# EAGLE schematic mixer headphone amp (EAGLE 6.4)
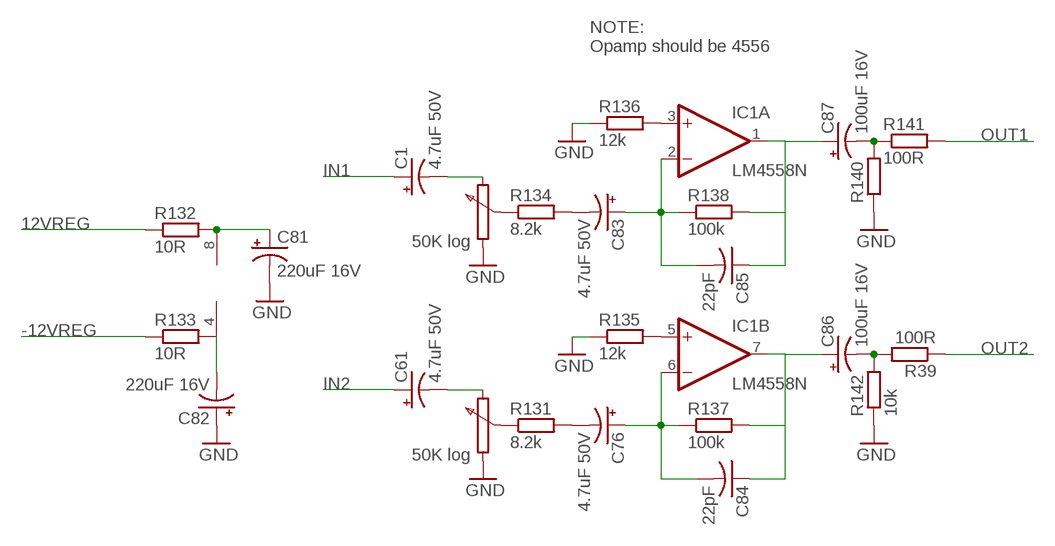
[diagram p0: schematic, sheet 1]

## Parts
C1  4.7uF 50V  CPOL-USE2.5-5  [E2,5-5]
C61  4.7uF 50V  CPOL-USE2.5-5  [E2,5-5]
C76  4.7uF 50V  CPOL-USE2.5-5  [E2,5-5]
C81  220uF 16V  CPOL-USE2.5-5  [E2,5-5]
C82  220uF 16V  CPOL-USE2.5-5  [E2,5-5]
C83  4.7uF 50V  CPOL-USE2.5-5  [E2,5-5]
C84  22pF  C-US025-025X050  [C025-025X050]
C85  22pF  C-US025-025X050  [C025-025X050]
C86  100uF 16V  CPOL-USE2.5-5  [E2,5-5]
C87  100uF 16V  CPOL-USE2.5-5  [E2,5-5]
IC1  LM4558N  [DIL08]
R39  100R  R-EU_0204/7  [0204/7]
R131  8.2k  R-EU_0204/7  [0204/7]
R132  10R  R-EU_0204/7  [0204/7]
R133  10R  R-EU_0204/7  [0204/7]
R134  8.2k  R-EU_0204/7  [0204/7]
R135  12k  R-EU_0204/7  [0204/7]
R136  12k  R-EU_0204/7  [0204/7]
R137  100k  R-EU_0204/7  [0204/7]
R138  100k  R-EU_0204/7  [0204/7]
R140  R-EU_0204/7  [0204/7]
R141  100R  R-EU_0204/7  [0204/7]
R142  10k  R-EU_0204/7  [0204/7]

## Nets
12VREG: R132.1
-12VREG: R133.1
GND: C81.- C82.+ R135.1 R136.1 R140.1 R142.1
IN1: C1.+
IN2: C61.+
N$1: IC1.3(A:+IN) R136.2
N$2: C82.- IC1.4(P:V-) R133.2
N$3: C81.+ IC1.8(P:V+) R132.2
N$4: C83.+ C85.2 IC1.2(A:-IN) R138.1
N$5: C85.1 C87.+ IC1.1(A:OUT) R138.2
N$6: C87.- R140.2 R141.1
N$8: C76.+ C84.2 IC1.6(B:-IN) R137.1
N$9: C84.1 C86.+ IC1.7(B:OUT) R137.2
N$10: C86.- R39.2 R142.2
N$12: C83.- R134.2
N$13: IC1.5(B:+IN) R135.2
N$14: C76.- R131.2
N$15: C1.-
N$16: C61.-
OUT1: R141.2
OUT2: R39.1
Unconnected: R131.1 R134.1

## Notes on the sheet
- NOTE:
  Opamp should be 4556
- 50K log
- 50K log

## Library data of the parts
C1 C61 C76 C81-C83 C86 C87 = resistor:CPOL-US: POLARIZED CAPACITOR, American symbol
C84 C85 = resistor:C-US: CAPACITOR, American symbol
IC1 = linear:*4558: OP AMP
R39 R131-R138 R140-R142 = resistor:R-EU_: RESISTOR, European symbol